# Altium schematic sheet TK531_Utgangstrinn.SchDoc: TK531 Utgangstrinn
size A3; Author: Øystein Smith; Organization: Omega Verksted; DocumentNumber: 18; Revision: 2; SheetNumber: 18; SheetTotal: 20
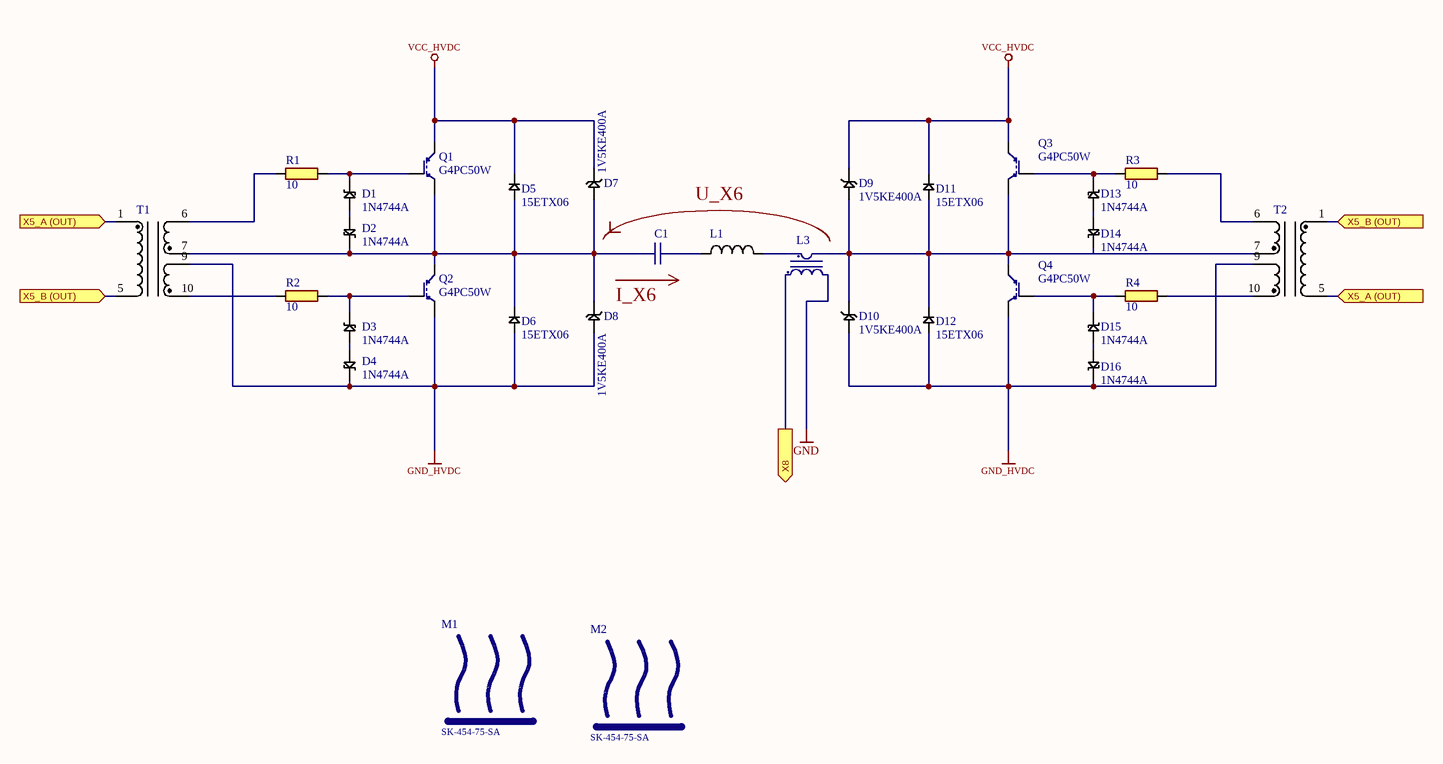
[diagram p0: TK531_Utgangstrinn.SchDoc]

## Parts
C1  PC/HV/S/WF 22NF  [CAPAD340W1L280D11B]  (value not drawn)
D1  1N4744A  [DO-41]
D2  1N4744A  [DO-41]
D3  1N4744A  [DO-41]
D4  1N4744A  [DO-41]
D5  15ETX06  [TO-220-2P]
D6  15ETX06  [TO-220-2P]
D7  1V5KE400A  [DO-201]
D8  1V5KE400A  [DO-201]
D9  1V5KE400A  [DO-201]
D10  1V5KE400A  [DO-201]
D11  15ETX06  [TO-220-2P]
D12  15ETX06  [TO-220-2P]
D13  1N4744A  [DO-41]
D14  1N4744A  [DO-41]
D15  1N4744A  [DO-41]
D16  1N4744A  [DO-41]
L1  SMD spoler  [INDP3225X20N]  (value not drawn)
L3  CurrentSenseTransformer  (value not drawn)
M1  SK-454-75-SA  [SK-454-75-SA]
M2  SK-454-75-SA  [SK-454-75-SA]
Q1  G4PC50W
Q2  G4PC50W  [TO-247]
Q3  G4PC50W
Q4  G4PC50W  [TO-247]
R1  10  [RESA_0.25W]
R2  10  [RESA_0.25W]
R3  10  [RESA_0.25W]
R4  10  [RESA_0.25W]
T1  Dual Gate Drive Transformer  [SD250-3]  (value not drawn)
T2  Dual Gate Drive Transformer  [SD250-3]  (value not drawn)

## Ports
X5_A (OUT) (in), X5_B (OUT) (in), X8 (out)

## Nets
GND: L3.3
GND_HVDC: D4.2(K) D6.1(A) D8.1(A) D10.1(A) D12.1(A) D16.2(K) Q2.3(E) Q4.3(E) T1.9 T2.9
VCC_HVDC: D5.3(K) D7.2(K) D9.2(K) D11.3(K) Q1.2(C) Q3.2(C)
X5_A (OUT): T1.1 T2.5 ; port X5_A (OUT)
X5_B (OUT): T1.5 T2.1 ; port X5_B (OUT)
X8: L3.4 ; port X8
NetC1_1: C1.1 D2.2(K) D5.1(A) D6.3(K) D7.1(A) D8.2(K) Q1.3(E) Q2.2(C) T1.7
NetC1_2: C1.2 L1.1
NetD1_1: D1.1(A) D2.1(A)
NetD1_2: D1.2(K) Q1.1(G) R1.2
NetD3_1: D3.1(A) D4.1(A)
NetD3_2: D3.2(K) Q2.1(G) R2.2
NetD9_1: D9.1(A) D10.2(K) D11.1(A) D12.3(K) D14.2(K) L3.1 Q3.3(E) Q4.2(C) T2.7
NetD13_1: D13.1(A) D14.1(A)
NetD13_2: D13.2(K) Q3.1(G) R3.2
NetD15_1: D15.1(A) D16.1(A)
NetD15_2: D15.2(K) Q4.1(G) R4.2
NetL1_2: L1.2 L3.2
NetR1_1: R1.1 T1.6
NetR2_1: R2.1 T1.10
NetR3_1: R3.1 T2.6
NetR4_1: R4.1 T2.10

## Notes on the sheet
- U_X6
- I_X6
- Size:
- Date:
- Title:
- A3
- Revision:
- Sheet
- of
- Author:
- File:

## Library data of the parts
C1 = 3176: CAP, FILM, PP, 22NF, 1.5KV, AXIAL; id: 3176; pakke_opprettet_av: 815; leverandor_varenr: 9520384; pris: 10; nokkelord: Capacitor, Kondensator; produsent: LCR Components; leverandor: Farnell; pakketype: TH; pakke_opprettet: 07.06.2015 15:46:51; symbol_opprettet_av: 815; symbol_opprettet: 14.11.2014 20:19:34; navn: PC/HV/S/WF 22NF
D1-D4 D13-D16 = 2367: id: 2367; pakke_opprettet_av: 815; pakke_opprettet: 28.06.2014 16.50.18; symbol_opprettet: 28.06.2014 15.11.05; beskrivelse: Zenerdiode 15V 1.3W; leverandor_varenr: 1612369; pris: 2; produsent: Vishay; leverandor: Farnell; pakketype: DO; symbol_opprettet_av: 815; navn: 1N4744A
D5 D6 D11 D12 = 2371: pakke_opprettet_av: 815; pakke_opprettet: 28.06.2014 18.52.03; symbol_opprettet: 07.06.2015 11.24.04; leverandor_varenr: 8656991; pris: 26; pakketype: TO-220; produsent: Vishay; leverandor: Farnell; id: 2371; beskrivelse: DIODE, HYPERFAST, 15A, 600V; navn: 15ETX06; symbol_opprettet_av: 815
D7-D10 = 2370: pakke_opprettet_av: 815; pakke_opprettet: 28.06.2014 17.58.10; symbol_opprettet: 28.06.2014 15.19.53; leverandor_varenr: 1017630; pris: 7; pakketype: DO; produsent: Fairchild; leverandor: Farnell; id: 2370; rad: 2; rom: OV; lager_type: Fremlager; dybde: 1; hylle: 6; antall: 16; beskrivelse: TVSdiode,  400V, 1500W; navn: 1V5KE400A; symbol_opprettet_av: 815; kolonne: 1
L1 = 1739: SMD inductors og tomme SMD bokser; id: 1739; pakke_opprettet_av: 924; pris: -1; pakke_opprettet: 26.05.2015 23:51:10; symbol_opprettet_av: 924; symbol_opprettet: 27.05.2015 00:20:21; navn: SMD spoler; pakketype: SMD
L3 = 3771: id: 3771; symbol_opprettet_av: 815; pris: 100; produsent: OV; symbol_opprettet: 29.09.2016 16:19:11; navn: CurrentSenseTransformer; pakketype: -
M1 M2 = 3175: Heatsink; rad: 4; rom: OV; lager_type: Fremlager; dybde: 0; hylle: 2; antall: 40; pakke_opprettet_av: 815; pakke_opprettet: 07.06.2015 12.19.05; symbol_opprettet: 07.06.2015 12.24.06; pris: 14; nokkelord: Kjøleribbe; produsent: FischerElektronik; id: 3175; leverandor_varenr: 1850030; leverandor: Farnell; navn: SK-454-75-SA; kolonne: 4; symbol_opprettet_av: 815; pakketype: -
Q1 Q3 = 2365: IGBT, 600V, 55A; pakke_opprettet_av: 815; pakke_opprettet: 28.06.2014 15.05.36; symbol_opprettet: 28.06.2014 15.03.36; leverandor_varenr: 8650632; pris: 77; nokkelord: Tesla; pakketype: TO-247; produsent: International Rectifier; leverandor: Farnell; id: 2365; navn: G4PC50W; symbol_opprettet_av: 815
Q2 Q4 = 2365: IGBT, 600V, 55A; pakke_opprettet_av: 815; pakke_opprettet: 28.06.2014 15.05.36; symbol_opprettet: 28.06.2014 15.03.36; leverandor_varenr: 8650632; pris: 77; nokkelord: Tesla; produsent: International Rectifier; leverandor: Farnell; id: 2365; navn: G4PC50W; symbol_opprettet_av: 815; pakketype: TO-247
R1-R4 = 2759: 0.25W 1% Generic resistor; id: 2759; rad: 1; rom: OV; lager_type: Fremlager; dybde: 0; hylle: 8; antall: 100; pakke_opprettet_av: 815; symbol_opprettet_av: oystesm; nokkelord: Motstand, Resistor; pakketype: 92; kolonne: 0; pakke_opprettet: 28.06.2014 17:13:33; symbol_opprettet: 08.07.2014 21:16:33; navn: 10; pris: 0
T1 T2 = 2374: id: 2374; pakke_opprettet_av: 815; pris: -1; nokkelord: GDT, Tesla; produsent: Coilcraft; pakketype: TH; pakke_opprettet: 28.06.2014 18:37:26; symbol_opprettet_av: 815; symbol_opprettet: 28.06.2014 15:27:34; navn: SD250-3